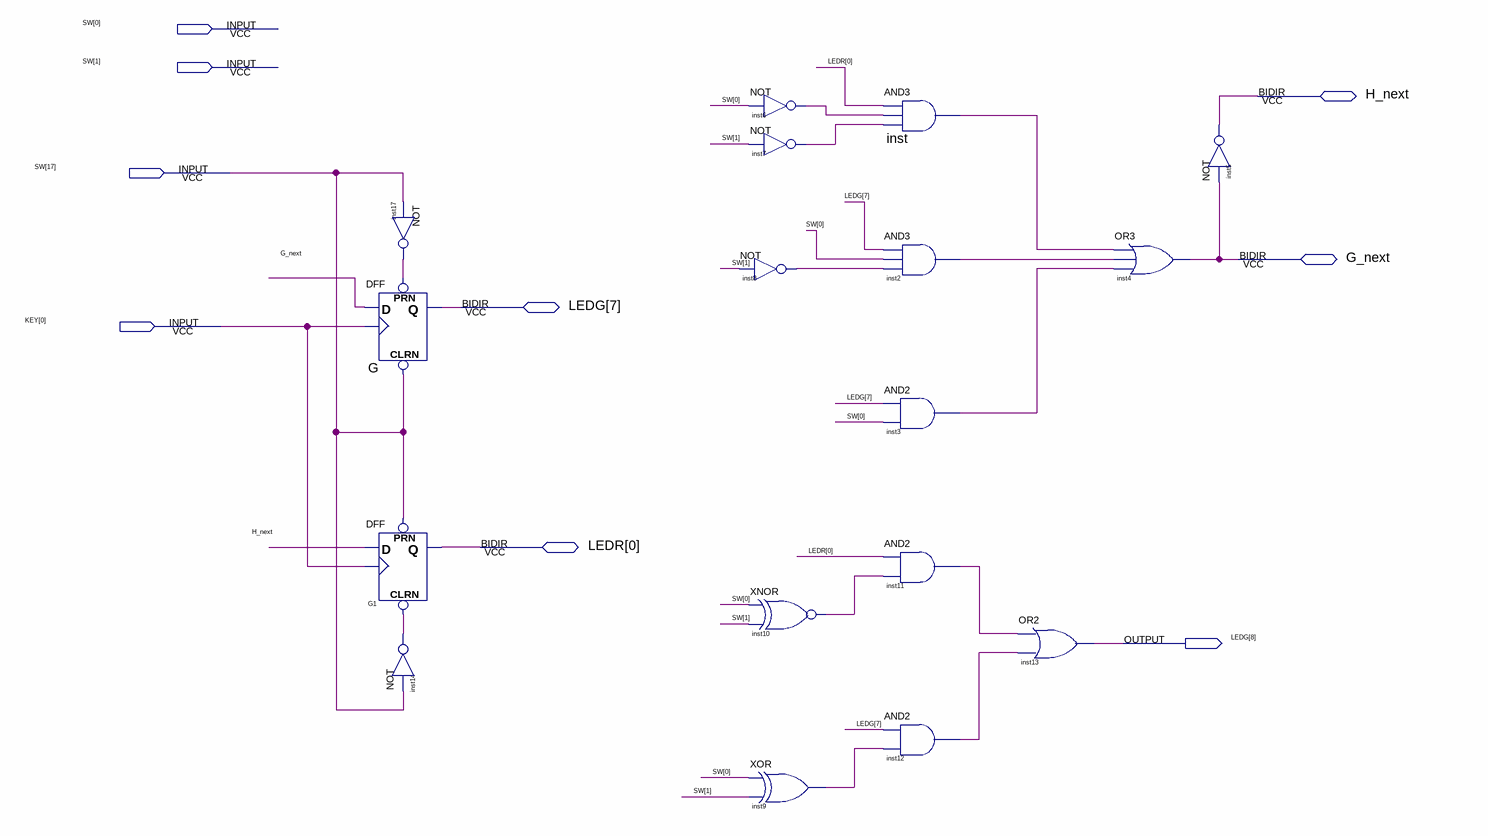
[diagram p0: schematic sheet]
// Quartus schematic L1_Q6_statemachine.bdf as structural Verilog: 17 symbols, 9 pins
module L1_Q6_statemachine (
  input  [17:0] SW,
  input  [0:0] KEY,
  inout  H_next,
  inout  G_next,
  inout  [8:7] LEDG,
  inout  [0:0] LEDR
);

  wire inst2_out, inst3_out, inst6_out, inst7_out, inst8_out, inst9_out, inst10_out, inst11_out, inst12_out,
       inst14_out, inst17_out, inst_out;

  DFF G (.CLRN(SW[17]), .CLK(KEY[0]), .D(G_next), .PRN(inst17_out), .Q(LEDG[7]));
  DFF G1 (.CLRN(inst14_out), .CLK(KEY[0]), .D(H_next), .PRN(SW[17]), .Q(LEDR[0]));
  not inst17 (inst17_out, SW[17]);
  not inst14 (inst14_out, SW[17]);
  not inst6 (inst6_out, SW[0]);
  not inst7 (inst7_out, SW[1]);
  not inst8 (inst8_out, SW[1]);
  xnor inst10 (inst10_out, SW[0], SW[1]);
  xor inst9 (inst9_out, SW[0], SW[1]);
  and inst (inst_out, LEDR[0], inst6_out, inst7_out);
  and inst2 (inst2_out, LEDG[7], SW[0], inst8_out);
  and inst3 (inst3_out, LEDG[7], SW[0]);
  and inst11 (inst11_out, LEDR[0], inst10_out);
  and inst12 (inst12_out, LEDG[7], inst9_out);
  or inst13 (LEDG[8], inst11_out, inst12_out);
  or inst4 (G_next, inst_out, inst2_out, inst3_out);
  not inst5 (H_next, G_next);
endmodule
